# EAGLE design source_eagle (EAGLE 9.6.2)
COMPANY: ADAFRUIT INDUSTRIES; DRAWN: KTOWN; REV: B
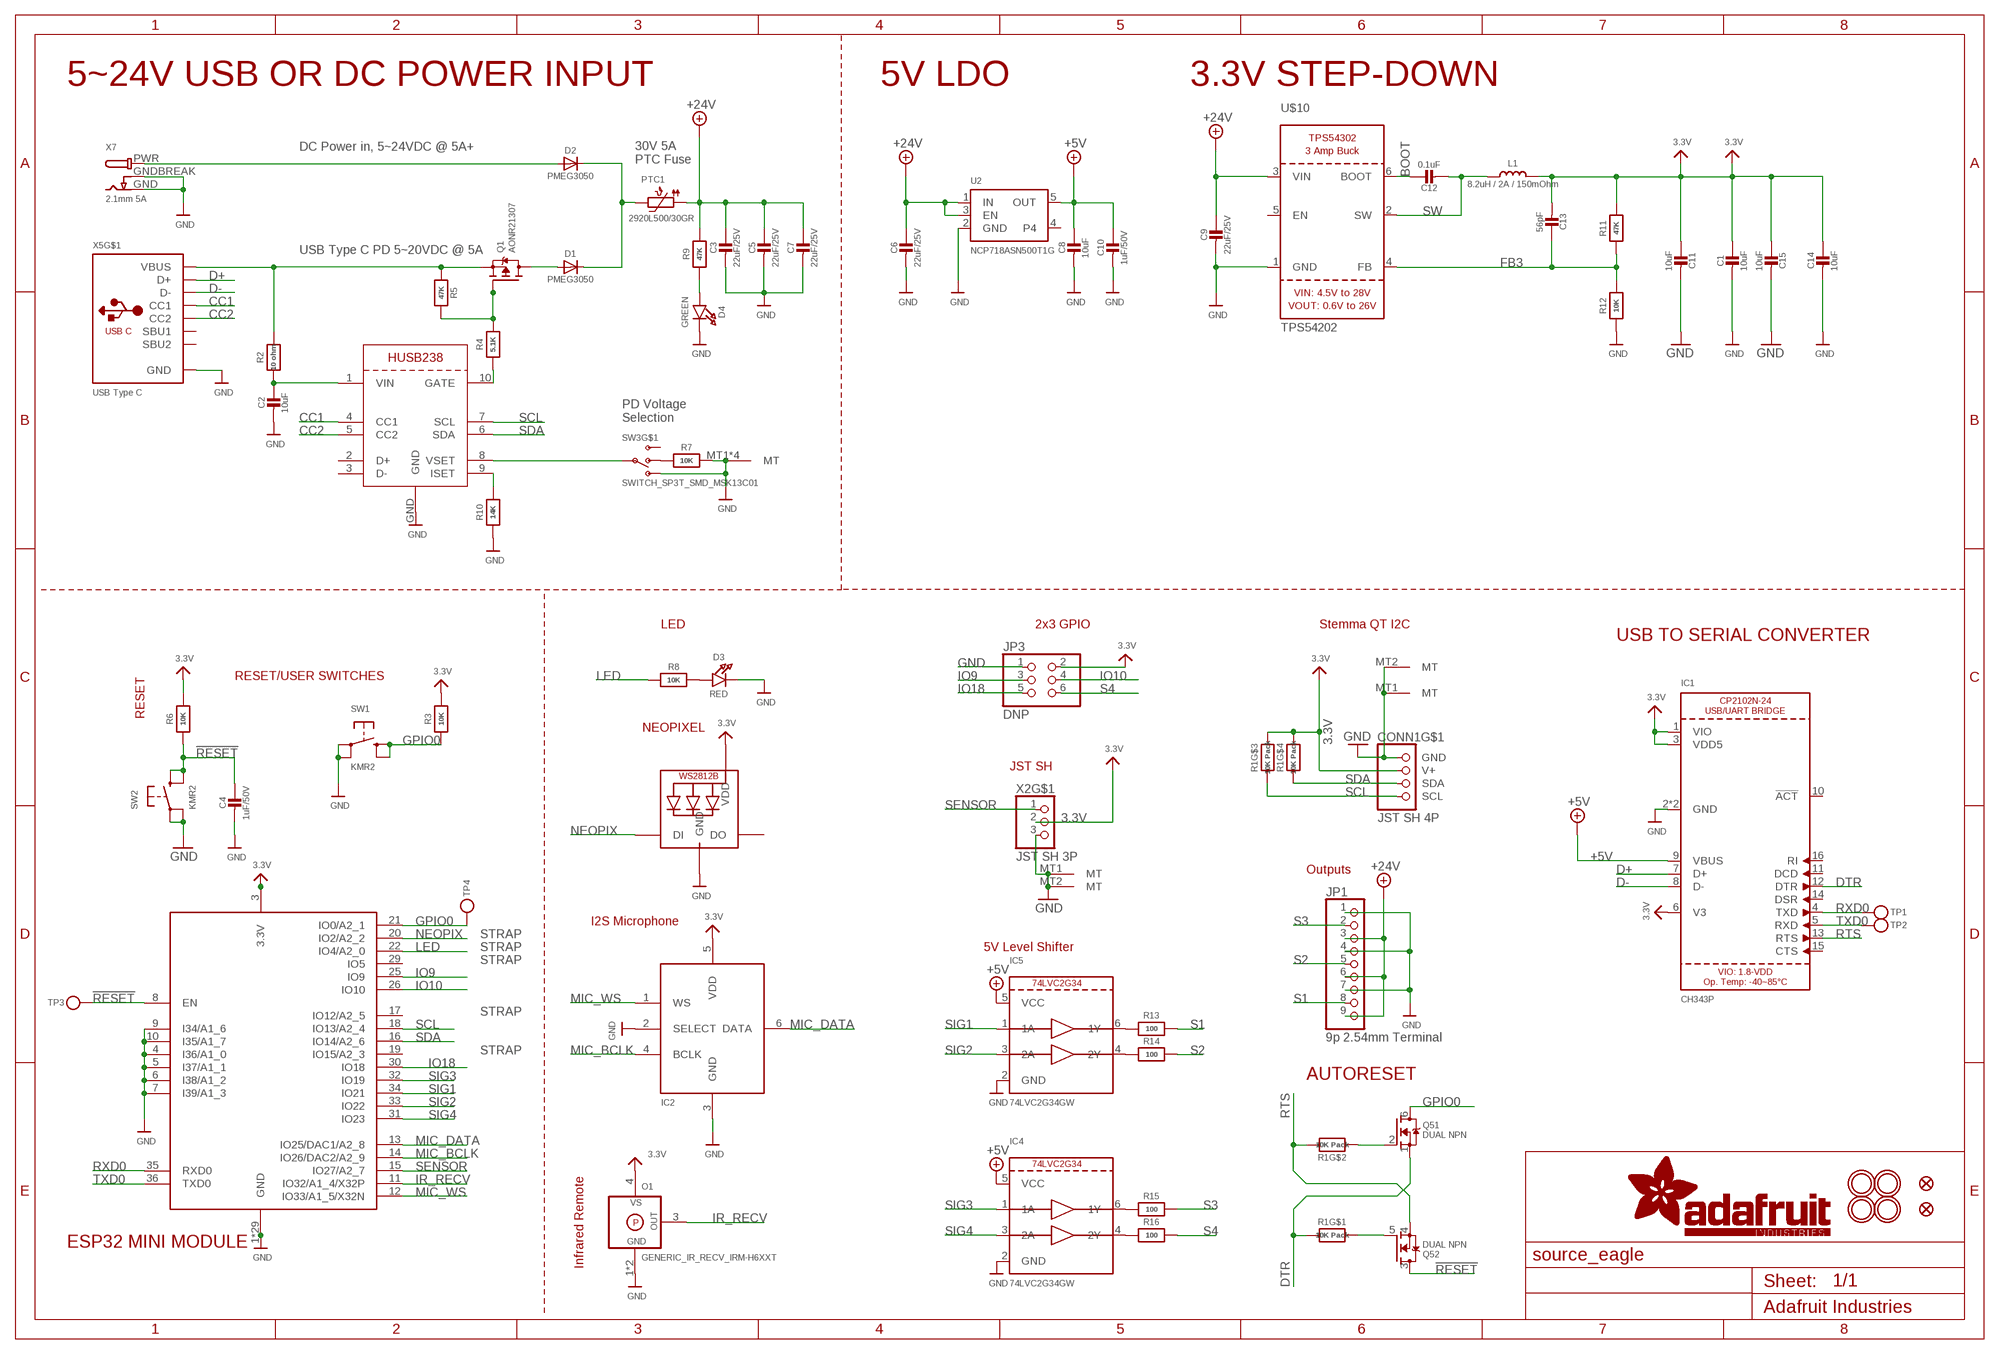
[diagram p0: schematic, sheet 1]

## Parts
C1  10uF  CAP_CERAMIC0805-NOOUTLINE  [0805-NO]
C2  10uF  CAP_CERAMIC0805-NOOUTLINE  [0805-NO]
C3  22uF/25V  CAP_CERAMIC0805-NOOUTLINE  [0805-NO]
C4  1uF/50V  CAP_CERAMIC0603_NO  [0603-NO]
C5  22uF/25V  CAP_CERAMIC0805-NOOUTLINE  [0805-NO]
C6  22uF/25V  CAP_CERAMIC0805-NOOUTLINE  [0805-NO]
C7  22uF/25V  CAP_CERAMIC0805-NOOUTLINE  [0805-NO]
C8  10uF  CAP_CERAMIC0805-NOOUTLINE  [0805-NO]
C9  22uF/25V  CAP_CERAMIC0805-NOOUTLINE  [0805-NO]
C10  1uF/50V  CAP_CERAMIC0603_NO  [0603-NO]
C11  10uF  CAP_CERAMIC0805-NOOUTLINE  [0805-NO]
C12  0.1uF  CAP_CERAMIC0603_NO  [0603-NO]
C13  56pF  CAP_CERAMIC0603_NO  [0603-NO]
C14  10uF  CAP_CERAMIC0805-NOOUTLINE  [0805-NO]
C15  10uF  CAP_CERAMIC0805-NOOUTLINE  [0805-NO]
CONN1  JST SH 4P  STEMMA_I2C_QT  [JST_SH4]
D1  PMEG3050  DIODE_SOD128  [SOD-128]
D2  PMEG3050  DIODE_SOD128  [SOD-128]
D3  RED  LED0603_NOOUTLINE  [CHIPLED_0603_NOOUTLINE]
D4  GREEN  LED0603_NOOUTLINE  [CHIPLED_0603_NOOUTLINE]
IC1  CH343P  [QFN16_3MM]
IC2  ICS-43434  MIC_I2S_SPH0645  [SPH0645LM4H]
IC4  74LVC2G34GW  [SC70-6L]
IC5  74LVC2G34GW  [SC70-6L]
JP1  9p 2.54mm Terminal  HEADER-1X9_2.54MMTERM  [1X09_2.54MMTERMINAL]
JP3  DNP  HEADER-2X3  [2X03_ROUND_70MIL]
L1  8.2uH / 2A / 150mOhm  INDUCTORNR5040  [INDUCTOR_5X5MM_NR5040_NOTHERMALS]
LED1  WS2812B_SK6805_1515  [SK6805_1515]
O1  GENERIC_IR_RECV_IRM-H6XXT  [IRM-H6XXT]
PTC1  2920L500/30GR  PTC_2920  [PTC2920]
Q1  AONR21307  MOSFET-P-POWERDI3333  [POWERDI3333]
Q5  DUAL NPN  MOSFET-N_DUAL  [SOT363]
R1  10K Pack  RESISTOR_4PACK  [RESPACK_4X0603]
R2  10 ohm  RESISTOR_0603_NOOUT  [0603-NO]
R3  10K  RESISTOR_0603_NOOUT  [0603-NO]
R4  5.1K  RESISTOR_0603_NOOUT  [0603-NO]
R5  47K  RESISTOR_0603_NOOUT  [0603-NO]
R6  10K  RESISTOR_0603_NOOUT  [0603-NO]
R7  10K  RESISTOR_0603_NOOUT  [0603-NO]
R8  10K  RESISTOR_0603_NOOUT  [0603-NO]
R9  47K  RESISTOR_0603_NOOUT  [0603-NO]
R10  14K  RESISTOR_0603_NOOUT  [0603-NO]
R11  47K  RESISTOR_0603_NOOUT  [0603-NO]
R12  10K  RESISTOR_0603_NOOUT  [0603-NO]
R13  100  RESISTOR_0603_NOOUT  [0603-NO]
R14  100  RESISTOR_0603_NOOUT  [0603-NO]
R15  100  RESISTOR_0603_NOOUT  [0603-NO]
R16  100  RESISTOR_0603_NOOUT  [0603-NO]
SW1  KMR2  SWITCH_TACT_SMT_RKB2  [BTN_RKB2_4.6X2.8]
SW2  KMR2  SWITCH_TACT_SMT_RKB2  [BTN_RKB2_4.6X2.8]
SW3  SWITCH_SP3T_SMD_MSK13C01  [MSK-13C01]
TP1  TESTPOINTROUND1.5MM  [TESTPOINT_ROUND_1.5MM]
TP2  TESTPOINTROUND1.5MM  [TESTPOINT_ROUND_1.5MM]
TP3  TESTPOINTROUND1.5MM  [TESTPOINT_ROUND_1.5MM]
TP4  TESTPOINTROUND1.5MM  [TESTPOINT_ROUND_1.5MM]
U2  NCP718ASN500T1G  VREG_SOT23-5  [SOT23-5]
U$10  TPS54202  TPS54302  [SOT23-6]
U$14  MOUNTINGHOLE2.5  [MOUNTINGHOLE_2.5_PLATED]
U$20  MOUNTINGHOLE2.5  [MOUNTINGHOLE_2.5_PLATED]
U$28  MOUNTINGHOLE2.5  [MOUNTINGHOLE_2.5_PLATED]
U$31  MOUNTINGHOLE2.5  [MOUNTINGHOLE_2.5_PLATED]
U$34  FIDUCIAL_1MM  [FIDUCIAL_1MM]
U$35  FIDUCIAL_1MM  [FIDUCIAL_1MM]
X2  JST SH 3P  CON_JST_SH_3PINHORZ  [JST_SH3]
X3  HUSB238  [DFN10_3X3MM]
X4  ESP32-MINI-1  [ESP32-MINI-1]
X5  USB Type C  USB_C  [USB_C_CUSB31-CFM2AX-01-X]
X7  2.1mm 5A  DCBARRELPTH  [DCJACK_2MM_PTH]

## Nets
3.3V: C1.1 C11.1 C13.2 C14.1 C15.1 CONN1.2(V+) IC1.1(VIO) IC1.3(VDD5) IC1.6(V3) IC2.5(VDD) JP3.2 L1.P$2 LED1.2(VDD) O1.4(VS) R1.5 R1.6 R3.2 R6.2 R11.2 X2.2 X4.3(3.3V)
!RESET: C4.1 Q5.3(2:D) R6.1 SW2.B'(S1) SW2.B(S) TP3.P$1 X4.8(EN)
+5V: C8.1 C10.1 IC1.9(VBUS) IC4.5(VCC) IC5.5(VCC) U2.5(OUT)
+24V: C3.1 C5.1 C6.1 C7.1 C9.1 JP1.3 JP1.6 JP1.9 PTC1.P$1 R9.2 U2.1(IN) U2.3(EN) U$10.3(VIN)
BOOT: C12.1 U$10.6(BOOT)
CC1: X3.4(CC1) X5.A5(CC1)
CC2: X3.5(CC2) X5.B5(CC2)
D+: IC1.7(D+) X5.A6(D+) X5.B6(D+)
D-: IC1.8(D-) X5.A7(D-) X5.B7(D-)
DTR: IC1.12(DTR) Q5.1(1:S) R1.1
FB3: C13.1 R11.1 R12.2 U$10.4(FB)
GND: C1.2 C2.2 C3.2 C4.2 C5.2 C6.2 C7.2 C8.2 C9.2 C10.2 C11.2 C14.2 C15.2 CONN1.1(GND) CONN1.MT1(MT) CONN1.MT2(MT) D3.C D4.C IC1.2(GND) IC1.THERMAL(GND) IC2.2(SELECT) IC2.3(GND) IC4.2(GND) IC5.2(GND) JP1.1 JP1.4 JP1.7 JP3.1 LED1.4(GND) O1.1(GND) O1.2(GND) R7.1 R10.1 R12.1 SW1.A'(P1) SW1.A(P) SW2.A'(P1) SW2.A(P) SW3.4 SW3.MT1(MT) SW3.MT2(MT) SW3.MT3(MT) SW3.MT4(MT) U2.2(GND) U$10.1(GND) X2.3 X2.MT1(MT) X2.MT2(MT) X3.GND X4.1(GND) X4.2(GND) X4.4(I36/A1_0) X4.5(I37/A1_1) X4.6(I38/A1_2) X4.7(I39/A1_3) X4.9(I34/A1_6) X4.10(I35/A1_7) X4.27(GND) X4.38(GND) X4.39(GND) X4.40(GND) X4.41(GND) X4.42(GND) X4.43(GND) X4.44(GND) X4.45(GND) X4.46(GND) X4.47(GND) X4.48(GND) X4.49(GND) X4.50(GND) X4.51(GND) X4.52(GND) X4.53(GND) X4.54(GND) X4.55(GND) X4.56(GND) X4.57(GND) X4.58(GND) X4.59(GND) X4.60(GND) X4.61(GND) X4.62(GND) X4.63(GND) X5.A1B12(GND) X5.B1A12(GND) X7.GND X7.GNDBREAK
GPIO0: Q5.6(1:D) R3.1 SW1.B'(S1) SW1.B(S) TP4.P$1 X4.21(IO0/A2_1)
IO9: JP3.3 X4.25(IO9)
IO10: JP3.4 X4.26(IO10)
IO18: JP3.5 X4.30(IO18)
IR_RECV: O1.3(OUT) X4.11(IO32/A1_4/X32P)
LED: R8.1 X4.22(IO4/A2_0)
MIC_BCLK: IC2.4(BCLK) X4.14(IO26/DAC2/A2_9)
MIC_DATA: IC2.6(DATA) X4.13(IO25/DAC1/A2_8)
MIC_WS: IC2.1(WS) X4.12(IO33/A1_5/X32N)
N$1: D3.A R8.2
N$2: C2.1 R2.1 X3.1(VIN)
N$3: Q1.4(G) R4.2 R5.2
N$4: R4.1 X3.10(GATE)
N$5: SW3.3(P) X3.8(VSET)
N$6: R7.2 SW3.2
N$7: Q5.5(2:G) R1.8
N$8: Q5.2(1:G) R1.2
N$9: D2.A X7.PWR
N$10: IC5.6(1Y) R13.1
N$11: IC5.4(2Y) R14.1
N$12: R10.2 X3.9(ISET)
N$13: D1.C D2.C PTC1.P$2
N$14: D1.A Q1.5678(D)
N$15: D4.A R9.1
N$18: IC4.6(1Y) R15.1
N$19: IC4.4(2Y) R16.1
NEOPIX: LED1.1(DI) X4.20(IO2/A2_2)
RTS: IC1.13(RTS) Q5.4(2:S) R1.7
RXD0: IC1.4(TXD) TP1.P$1 X4.35(RXD0)
S1: JP1.8 R13.2
S2: JP1.5 R14.2
S3: JP1.2 R15.2
S4: JP3.6 R16.2
SCL: CONN1.4(SCL) R1.3 X3.7(SCL) X4.18(IO13/A2_4)
SDA: CONN1.3(SDA) R1.4 X3.6(SDA) X4.16(IO14/A2_6)
SENSOR: X2.1 X4.15(IO27/A2_7)
SIG1: IC5.1(1A) X4.34(IO21)
SIG2: IC5.3(2A) X4.33(IO22)
SIG3: IC4.1(1A) X4.32(IO19)
SIG4: IC4.3(2A) X4.31(IO23)
SW: C12.2 L1.P$1 U$10.2(SW)
TXD0: IC1.5(RXD) TP2.P$1 X4.36(TXD0)
VBUS1: Q1.1(S) Q1.2(S) Q1.3(S) R2.2 R5.1 X5.A4B9(VBUS) X5.B4A9(VBUS)
Unconnected: IC1.10(!ACT) IC1.11(DCD) IC1.14(DSR) IC1.15(CTS) IC1.16(RI) LED1.3(DO) SW3.1 U2.4 U$10.5(EN) X3.2(D+) X3.3(D-) X4.17(IO12/A2_5) X4.19(IO15/A2_3) X4.29(IO5) X5.A8(SBU1) X5.B8(SBU2) X5.M1(MT) X5.M2(MT) X5.M3(MT) X5.M4(MT)

## Notes on the sheet
- 5~24V USB OR DC POWER INPUT | 5V LDO | 3.3V STEP-DOWN
- DC Power in, 5~24VDC @ 5A+
- 30V 5A
  PTC Fuse
- USB Type C PD 5~20VDC @ 5A
- PD Voltage
  Selection
- LED | 2x3 GPIO | Stemma QT I2C
- USB TO SERIAL CONVERTER
- RESET/USER SWITCHES
- RESET
- NEOPIXEL
- JST SH
- Outputs
- I2S Microphone
- STRAP
- STRAP | 5V Level Shifter
- STRAP
- STRAP
- STRAP
- AUTORESET
- Infrared Remote
- ESP32 MINI MODULE

## Library data of the parts
C1-C7 C9-C15 = microbuilder:CAP_CERAMIC: Ceramic Capacitors For new designs, use the packages preceded by an '_' character since they are more reliable: The following footprints should be used on most boards: _0402 - Standard footprint for regular board layouts _0603 - Standard footprint for regular board layouts _0805 - Standard footprint for regular board layouts _1206 - Standard footprint for regular board layouts For extremely tight-pitch boards where space is at a premium, the following 'micro-pitch' footprints can be used (smaller pads, no silkscreen outline, etc.): _0402MP - Micro-pitch footprint for very dense/compact boards _0603MP - Micro-pitch footprint for very dense/compact boards _0805MP - Micro-pitch footprint for very dense/compact boards _1206MP - Micro-pitch footprint for very dense/compact boards
C8 = microbuilder:CAP_CERAMIC: Ceramic Capacitors For new designs, use the packages preceded by an '_' character since they are more reliable: The following footprints should be used on most boards: _0402 - Standard footprint for regular board layouts _0603 - Standard footprint for regular board layouts _0805 - Standard footprint for regular board layouts _1206 - Standard footprint for regular board layouts For extremely tight-pitch boards where space is at a premium, the following 'micro-pitch' footprints can be used (smaller pads, no silkscreen outline, etc.): _0402MP - Micro-pitch footprint for very dense/compact boards _0603MP - Micro-pitch footprint for very dense/compact boards _0805MP - Micro-pitch footprint for very dense/compact boards _1206MP - Micro-pitch footprint for very dense/compact boards; REV: D
CONN1 = adafruit_electromech:STEMMA_I2C; LCSC: C2845363
D1 D2 = microbuilder:DIODE: Diode SMA Model Volts Amps Type Vf Ir Digikey # Notes SSA34-E3 40V 3A Schottky 480mV @ 3A 200uA @ 40V SSA34-E3/61TGITR-ND CDBA120-G 20V 1A Schottky 500mV @ 1A 500uA @ 20V 641-1014-6-ND REEL MBRA210 10V 2A Schottky 350mV @ 2A 700uA @ 10V MBRA210LT3 SOD-123 Model Volts Amps Type Vf Ir Order # Notes BAT54T1G 30V 200mA Schottky 800mV @ 200mA 2uA @ 25V BAT54T1GOSTR-ND B0530W 30V 500mA Schottky 430mV @ 500mA 130uA @ 30V B0530W-FDICT-ND REEL MBR120 20V 1A Schottky 340mV @ 1A MBR120VLSFT1GOSCT-ND SOD-323 Model Volts Amps Type Vf Ir Order # Notes PMEG2005EJ 20V 500mA Schottky 355mV @ 500mA 568-4110-1-ND ZLLS410 10V 570mA Schottky 380mV @ 570mA ZLLS410CT-ND 1N4148WS 75V 150mA Silicon/Simple 1V 1N4148WSFSCT-ND REEL SOD-523 Model Volts Amps Type Vf Ir Order # Notes BAT54XV2 30V 200mA Schottky 0.8V @ 100mA BAT54XV2CT-ND TB751S 30V 30mA Schottky RB751S-40TE61CT-ND SOT23-R/W (R = Solder Paste/Reflow Ovens, W = Hand-Soldering) Model Volts Amps Type Vf Ir Order # Notes BAT54FILM 40V 300mA Schottky 497-7162-1-ND POWERDI-5 Model Volts Amps Type Vf Ir Order # Notes PDS560 60V 5A Schottky 670mV @ 5A 150uA @ 60V PDS560DICT-ND
D3 D4 = microbuilder:LED: LED 0603 - 0603 Surface Mount Package 2mA: Green LED - Low Power (3.9mcd, 2ma, 1.7Vf) - Digikey: 475-2709-2-ND Orange LED - Low Power (9.8mcd, 2ma, 1.8Vf) - Digikey: 475-1194-2-ND Red LED - Low Power (5mcd, 2ma, 1.8Vf) - Digikey: 475-1195-2-ND Yellow LED - Low Power (7mcd, 2ma, 1.8Vf) - Digikey: 475-1196-2-ND 5mA: Blue LED - Low Power (17mcd, 5ma, 2.9Vf) - Digikey: LNJ937W8CRACT-ND 0805 - 0805 Surface Mount Package 2mA: Red LED (8.8mcd, 2mA, 1.8Vf, Clear) - Low Power [Digikey: 475-2510-1-ND] Green LED (5mcd, 2mA, 1.8Vf, Clear) - Low Power [Digikey: 475-2730-1-ND] Yellow LED (11.3mcd, 2mA, 1.8Vf, Clear) - Low Power [Digikey: 475-2555-1-ND] 20mA: Red LED (104mcd, 20mA, Diffused) - LS R976 [Digikey: 475-1278-6-ND] Red LED (12mcd, 20mA, 2.0Vf, Clear) - APT2012EC [Digikey: 754-1128-1-ND] Green LED (15mcd, 20mA, 2.2Vf, Clear) - APT2012GC [Digikey: 754-1131-1-ND] Orange LED (160mcd, 20mA, 2.1Vf, Clear) - APT2012SECK [Digikey: 754-1130-1-ND] 1206 - 1206 Surface Mount Package Green LED (26mcd, 20mA, Diffused) - LG N971 [Digikey: 475-1407-6-ND] Red LED (15mcd, 20mA, Diffused) - LH N974 [Digikey: 475-1416-6-ND] Cree - Cree High-Power Surface Mount LEDs XPEBWT-L1-0000-00D50 - White 111lm 350mA 2.9Vf 6200K 110° XTEAWT-00-0000-00000LEE3 - White 114lm 350mA 2.85Vf 5000K 115° Everlight - Everlight 45-21 Series Surface Mount LEDs 45-21/QK2C-B2832AC2CB2/2T - Warm White 2000mcd 20mA 3.25Vf 3050K 120° 45-21/LK2C-B38452C4CB2/2T - Nuetral White 2000mcd 20mA 3.25Vf 4150K 120° 45-21/LK2C-B50634C6CB2/2T - Cold White 2200mcd 20mA 3.25Vf 5650K 120° PLCC2 Reverse Mount LS T77K-J1L2-1-0-2-R18-Z - Red 11.25mcd 2mA 1.8Vf 630nm 120° LO T77K-L1M2-24-Z - Orange 19.6mcd 2mA 1.8Vf 606nm 120° LY T77K-K2M1-26-Z - Yellow 15.7mcd 2mA 1.8Vf 587nm 120°; ROT: 270
IC1 = microbuilder:CH343P
IC2 = microbuilder:MIC_I2S
IC4 IC5 = microbuilder:74LVC2G34
JP1 = microbuilder:HEADER-1X9: PIN HEADER
JP3 = microbuilder:HEADER-2X3: PIN HEADER
L1 = microbuilder:INDUCTOR: Inductors 0603: 10nH Ceramic Inductor - microwire antenna/RF (Digikey: 712-1434-2-ND) 0805: 560nH Ceramic Inductor - RF (Digikey: 553-1047-1-ND) 270nH Ceramic Inductor - Q = 40@250MHz, +-5%, 1 Ohm DC Resistance (Digikey: 535-10506-2-ND) 1007 (2518 Metric) SMT: 10µH 10% 250mOhm 820mA 1007 Inductor (Digikey: 587-2189-1-ND) 22µH 10% 500mOhm 580mA 1007 Inductor (Digikey: 587-2190-1-ND) 47µH 10% 950mOhm 420mA 1007 Inductor (Digikey: 587-2191-1-ND) 47µH 5% 100mOhm 1A 1008 Inductor (Digikey: 732-1816-1-ND) 5.0x5.0mm (Taiyo Yuden NR5040 Series) 6.8µH 20% 2.3A 64mOhm Inductor (Digikey: 587-2374-2-ND) 5.0x5.0mm (TDK VLC5045 Series) 4.7µH 20% 3.3A 34mOhm Inductor (Digikey: 445-6526-1-ND) 6.8µH 20% 2.7A 46mOhm Inductor (Digikey: 445-6527-1-ND) 6.0x6.0mm (TDK VLC6045 Series) 4.7µH 20% 3.8A 27mOhm Inductor (Digikey: 445-6538-2-ND) 6.8µH 20% 3A 41mOhm Inductor (Digikey: 445-6540-1-ND) 6.2µH 30% 2.2A 45mOhm Inductor (Digikey: SRR5028-6R2YCT-ND) - Not TDK VLC6045 but footprint should match 6.0x6.0mm (TDK SLF6045 Series) 6.8uH 30% 2A 33mOhm Inductor (Digikey: 445-4572-1-ND, Mouser: 810-SLF645T6R8N2R0PF) 6.0x6.0mm (Sumida CDRH5D28 Series) 6.2uH 30% 1.8A 45mOhm Inductor (Digikey: 308-1542-1-ND) Taiyo Yuden NR3015T2R2M - 2.2uH 20% 1.5A (Digikey: 587-1648-2-ND, Mouser: 963-NR3015T2R2M) - Used with TI TPS62172 CoilCraft RFID Transponder Coil - MA5532-AE (For use with AS3935 Lightning Sensor) Taiyo Yuden NRH2412T2R2MNGH - 2.2uH 20% 1AA (Digikey: 587-3443-1-ND) - Used with TI LM3671 Vishay IHLP 1.0uH Molded Inductor - 24mOhm DCR, 5A, +/-20%, -55°C-125°C (Digikey: 541-1319-1-ND)
LED1 = microbuilder:WS2812B; LCSC: C2890035
O1 = adafruit_sensor:GENERIC_IR_RECV
PTC1 = microbuilder:PTC: PTC (Resettable Fuse) 1206 Package 250mA PTC (16V Max, Time-to-Trip: 0.08s) - Digikey: F2110CT-ND 1210 Package 100mA PTC (30V Max, Time-to-Trip: 0.6s) - Digikey: MF-USMF010-2CT-ND 1812 Package 750mA PTC (24V Max, Time-to-Trip: 0.2s) - Digikey: MF-MSMF075/24-2CT-ND
Q1 = microbuilder:MOSFET-P: P-Channel Mosfet LEGEND VDS: Voltage Drain-Source ID: Drain Current RDS(ON): Drain-Source On-State Resistance VGS(TH): Gate-Source Threshold Voltage CISS: Drain-Source Input Capacitance SOT-23 Name VDS ID RDS(ON) VGS(TH) CISS Order Number IRLML5103 30V 760mA 600 mOhm -- 75pF @ 25V Digikey: IRLML5103PBFCT-ND IRLML6401 12V 4.3A 50 mOhm 950mV @ 250µA 830pF @ 10V Digikey: IRLML6401PBFTR-ND NTR0202PL 20V 400mA 800 mOhm 2.3V @ 250uA 70pF @ 5V Digikey: NTR0202PLT1GOSTR-ND NTR4101PT1G 20V 1.8A 85 mOhm 1.2V @ 250uA 675pF @ 10V Digikey: NTR4101PT1GOSCT-ND DMP2004K 20V 600mA 900 mOhm 1V @ 250uA 175pF @ 16V Digikey: DMP2004KDICT-ND PMV65XP 20V 3.9A 76 mOhm 950mV @ 1mA 725pF @ 20V Digikey: 568-2358-2-ND TO-252 Name VDS ID RDS(ON) VGS(TH) CISS Order Number AOD417 30V 25A 34 mOhm 3V @ 250µA 920pF @ 15V Digikey: 785-1106-2-ND PowerPak Name VDS ID RDS(ON) VGS(TH) CISS Order Number AON7401 30V 12A 14 mOhm 3V @ 250µA 2600pF @ 15V Digikey: 785-1302-1-ND; ROT: 270
Q5 = microbuilder:MOSFET-N_DUAL: Dual N-Channel MOSFET SOT363 (2.0x1.25mm) 2N7002PS - 60V, 320mA [Digikey: 568-5984-1-ND]; JLC_ROTATION: 0
R1 = microbuilder:RESISTOR_4PACK: Resistor Packs (4 resistors) 4 x 0603 10K 1/16W - Digikey: YC164J-10KCT-ND
R2-R16 = microbuilder:RESISTOR: Resistors For new designs, use the packages preceded by an '_' character since they are more reliable: The following footprints should be used on most boards: _0402 - Standard footprint for regular board layouts _0603 - Standard footprint for regular board layouts _0805 - Standard footprint for regular board layouts _1206 - Standard footprint for regular board layouts For extremely tight-pitch boards where space is at a premium, the following 'micro-pitch' footprints can be used (smaller pads, no silkscreen outline, etc.): _0402MP - Micro-pitch footprint for very dense/compact boards _0603MP - Micro-pitch footprint for very dense/compact boards _0805MP - Micro-pitch footprint for very dense/compact boards _1206MP - Micro-pitch footprint for very dense/compact boards
SW1 SW2 = adafruit_electromech:SWITCH_TACT_SMT: SMT Tact Switches RKB2 https://www.digikey.com/short/m027prz5
SW3 = adafruit_electromech:SWITCH_SP3T_SMD
TP1-TP4 = microbuilder:TESTPOINT: Test Point Various test points for characterisation and PCB testing TESTPOINT_SMT - Compact Surface Mount Test Point [Digikey: 5016KTR-ND]
U2 = adafruit_power:VREG_SOT23-5: SOT23-5 Fixed Voltage Regulators Part Current Out V Out V In V Dropout θJA (°C/W) TJ (°C) Digikey Part No. ADP121 150mA 3.3V 3.4-5.5V 0.09V @ 150mA -- -- ADP121-AUJZ33R7CT-ND ADP121 150mA 3.0V 3.1-5.5V 0.09V @ 150mA -- -- ADP121-AUJZ30R7CT-ND ADP122 300mA 3.3V 3.4-5.5V 0.085V @ 300mA -- -- ADP122AUJZ-3.3-R7CT-ND ADP1712 300mA 3.3V 3.5-5.5V 0.17V @ 300mA -- -- ADP1712AUJZ-3.3-R7TR-ND AP7311 (Low Cost) 150mA 3.3V 3.5-6V 0.15V @ 150mA -- -- AP7311-33WG-7DICT-ND LD39015M18R 150mA 1.8V 1.9V-5.5V 0.08V @ 100mA -- -- 497-6977-1-ND LP2985A-33DBVR 150mA 3.3V 3.3-16V 0.28V @ 150mA 206 150 296-18479-1-ND MCP1824T-3302E/OT 300mA 3.3V 3.5V-6V 0.2V @ 300mA -- -- MCP1824T-3302E/OTCT-ND MIC5205-2.5YM5 TR 150mA 2.5V 2.7-16V 0.165V @ 150mA -- -- 576-1257-2-ND MIC5205-3.0YM5 TR 150mA 3.0V 3.2V-16V 0.165V @ 150mA -- -- 576-1258-2-ND MIC5205-3.3YM5 TR 150mA 3.3V 3.5V-16V 0.165V @ 150mA -- -- 576-1259-2-ND TPS780330220 150mA 3.3V+2.2V 3.6-5.5V 250mV Max -- -- 296-23332-1-ND TDA3663/N1,135 100mA 3.3V 3.5-45V 0.18V @ 50mA -- -- 568-5343-1-ND Max operating temp can be calculated using θJA, TJ (max junction temperature), and power in watts. Set the "Maximum Ambient Temperature" until it reaches TJ ("Max Junction Temperature"), which is the absolute limit for safe use of the regulator: Heat Sink Temperature Calculator <http://www.daycounter.com/Calculators/Heat-Sink-Temperature-Calculator.phtml> For example, With 12V source into a 3.3V LP2985 and a 30mA load, we are dissipating (12V-3.3V) * 0.03A = 0.261W. With a θJA of 206 °C/W, a TJ of 150°C, and 261mW we can safely use the chip without a heat sink up to 75°C (=147.1°C Junction Temperature).; JLC_ROTATION: 0
U$10 = adafruit_power:TPS54302
U$14 U$20 U$28 U$31 = adafruit_electromech:MOUNTINGHOLE: Mounting Hole For #2 screws (0.086"/2.18mm width, 0.094"/2.4mm hole) use 2.5mm; BOM: EXCLUDE
U$34 U$35 = microbuilder:FIDUCIAL: Fiducial Alignment Points Various fiducial points for machine vision alignment.; BOM: EXCLUDE
X2 = adafruit_electromech:CON_JST_SH_3PIN
X3 = adafruit_power:HUSB238
X4 = adafruit_wireless:ESP32-MINI-1
X5 = adafruit_electromech:USB_C: USB Type-C USB 2.0 Connector; LCSC: C165948
X7 = adafruit_electromech:DCBARREL: DC Barrel Jack DCJACK_1.3MM_PTH - Through Hole 1.3mm Jack (4UConnector: 05536) DCJACK_2MM_PTH - Through Hole 2.0/2.1 Jack (4UConnector: 05537) DCJACK_2MM_SMT - SMT 2.0/2.1mm Jack(4UConnector: 03267)

## Net classes
1 power: width 0.305 mm

## Board
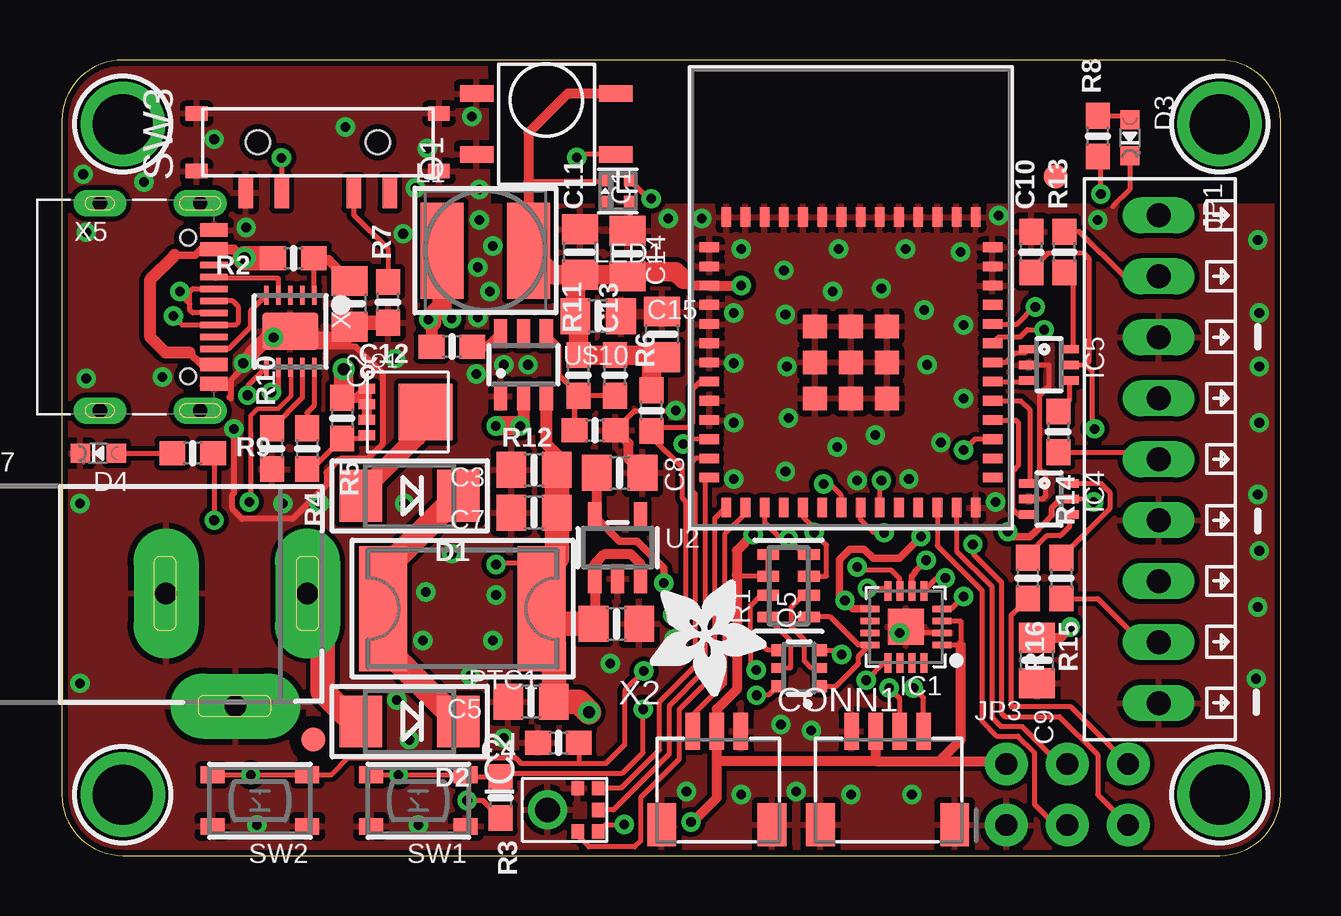
[diagram p1: board, top side]
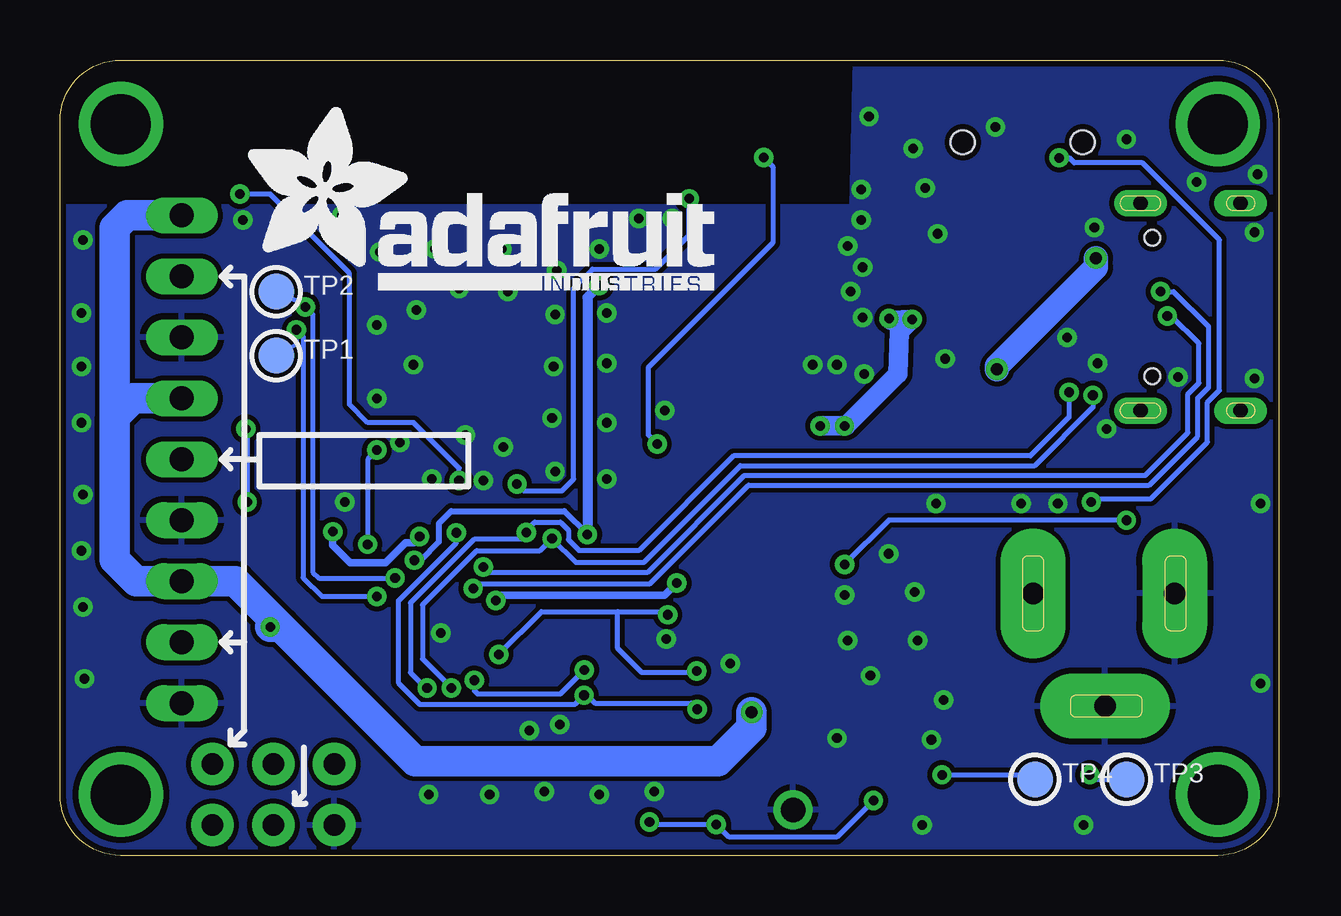
[diagram p2: board, bottom side, seen from below]

Size 50.8 x 33.15 mm. Coordinates in mm from the lower left corner, seen from the top.
Outline: 48.26,33.15 2.54,33.15 arc90 0,30.61 0,2.54 arc90 2.54,0 48.26,0 arc90 50.8,2.54 50.8,30.61 arc90 48.26,33.15
Copper layers (1*16): Top 0.035mm / dielectric 1.5mm / Bottom 0.035mm
Design rules "adafruit 7-7": minimum track width 7mil, minimum drill 15.5mil, track to track 8mil, track to pad 7mil, pad to pad 7mil, via to via 7mil, smd to smd 7mil, copper to edge 10mil, drill to drill 8mil, minimum pad ring 10mil, minimum via ring 8mil, stop-mask expansion 2mil, vias tented up to drill 20mil, thermal gap 10mil

### Footprints (pad centres in the part's own frame; a part is rotated, then mirrored left to right if it is on the bottom)
0805-NO = smd 1.24 x 1.5: 1 -0.95,0; 2 0.95,0
0603-NO = smd 1.075 x 1: 1 -0.85,0; 2 0.85,0
JST_SH4 = smd 0.6 x 1.55: 1 -1.5,2.006; 2 -0.5,2.006; 3 0.5,2.006; 4 1.5,2.006 | smd 1.2 x 1.8: MT1 -2.8,-1.894; MT2 2.8,-1.894
SOD-128 = smd 1.778 x 2.159: A 2.019,0; C -2.045,0
CHIPLED_0603_NOOUTLINE = smd 0.8 x 0.8: A 0,-0.75; C 0,0.75
QFN16_3MM = smd 0.8 x 0.28: 1 -1.5,0.75; 2 -1.5,0.25; 3 -1.5,-0.25; 4 -1.5,-0.75; 9 1.5,-0.75; 10 1.5,-0.25; 11 1.5,0.25; 12 1.5,0.75 | smd 0.28 x 0.8: 5 -0.75,-1.5; 6 -0.25,-1.5; 7 0.25,-1.5; 8 0.75,-1.5; 13 0.75,1.5; 14 0.25,1.5; 15 -0.25,1.5; 16 -0.75,1.5 | smd 1.5 x 1.5: THERMAL 0,0
SPH0645LM4H = smd 0.6 x 0.525: 1 -0.9,1.4; 2 -0.9,0.55; 4 0.9,0.55; 5 0.9,1.4; 6 0,1.4 | drill 1.025 pad 1.625: 3 0,-0.71
SC70-6L = smd 0.35 x 0.8: 1 -0.65,-0.85; 2 0,-0.85; 3 0.65,-0.85; 4 0.65,0.85; 5 0,0.85; 6 -0.65,0.85
1X09_2.54MMTERMINAL = drill 1 long: 1 10.16,0; 2 7.62,0; 3 5.08,0; 4 2.54,0; 5 0,0; 6 -2.54,0; 7 -5.08,0; 8 -7.62,0; 9 -10.16,0
2X03_ROUND_70MIL = drill 0.9 pad 1.778: 1 -2.54,-1.27; 2 -2.54,1.27; 3 0,-1.27; 4 0,1.27; 5 2.54,-1.27; 6 2.54,1.27
INDUCTOR_5X5MM_NR5040_NOTHERMALS = smd 1.8 x 4: P$1 -1.8,0; P$2 1.8,0
SK6805_1515 = smd 0.5 x 0.5: 1 -0.5,-0.45; 2 0.5,-0.45; 3 0.5,0.45; 4 -0.5,0.45
IRM-H6XXT = smd 0.7 x 1.4: 1 1.27,2.9; 2 -1.27,2.9; 3 -1.27,-2.9; 4 1.27,-2.9
PTC2920 = smd 2 x 5.2: P$1 -3.3,0; P$2 3.3,0
POWERDI3333 = smd 0.7 x 0.42: 1 -1.446,0.975; 2 -1.446,0.325; 3 -1.446,-0.325; 4 -1.446,-0.975 | smd 2.25 x 2.35: 5678 1.004,0
SOT363 = smd 0.5 x 0.5: 1 -0.75,-0.9; 3 0.75,-0.9; 4 0.75,0.9; 6 -0.75,0.9 | smd 0.4 x 0.5: 2 0,-0.9; 5 0,0.9
RESPACK_4X0603 = smd 0.45 x 0.9: 1 -1.3,-0.85; 2 -0.4,-0.85; 3 0.4,-0.85; 4 1.3,-0.85; 5 1.3,0.85; 6 0.4,0.85; 7 -0.4,0.85; 8 -1.3,0.85
BTN_RKB2_4.6X2.8 = smd 1 x 0.7: A 1.973,1.075; A' -1.973,1.075; B 1.973,-1.075; B' -1.973,-1.075
MSK-13C01 = smd 0.6 x 1.3: 1 -3,2.1; 2 -1.5,2.1; 3 1.5,2.1; 4 3,2.1 | smd 0.9 x 0.6: MT1 -5.05,1.2; MT2 -5.05,-1.2; MT3 5.05,-1.2; MT4 5.05,1.2 | hole 1: 2.5,0; -2.5,0
TESTPOINT_ROUND_1.5MM = smd 1.5 x 1.5: P$1 0,0
SOT23-5 = smd 0.55 x 1.2: 1 -0.95,-1.3; 2 0,-1.3; 3 0.95,-1.3; 4 0.95,1.3; 5 -0.95,1.3
SOT23-6 = smd 0.55 x 1.2: 1 -0.95,-1.3; 2 0,-1.3; 3 0.95,-1.3; 4 0.95,1.3; 5 0,1.3; 6 -0.95,1.3
MOUNTINGHOLE_2.5_PLATED = drill 2.5 pad 3.2: P$1 0,0
FIDUCIAL_1MM = smd 1 x 1: 1 0,0
JST_SH3 = smd 0.6 x 1.55: 1 -1,2.006; 2 0,2.006; 3 1,2.006 | smd 1.2 x 1.8: MT1 -2.3,-1.894; MT2 2.3,-1.894
DFN10_3X3MM = smd 0.25 x 0.8: 1 -1,-1.5; 2 -0.5,-1.5; 3 0,-1.5; 4 0.5,-1.5; 5 1,-1.5; 6 1,1.5; 7 0.5,1.5; 8 0,1.5; 9 -0.5,1.5; 10 -1,1.5 | smd 2.35 x 1.58: GND 0,0
ESP32-MINI-1 = smd 0.813 x 0.406: 1 -5.9,4.9; 2 -5.9,4.1; 3 -5.9,3.3; 4 -5.9,2.5; 5 -5.9,1.7; 6 -5.9,0.9; 7 -5.9,0.1; 8 -5.9,-0.7; 9 -5.9,-1.5; 10 -5.9,-2.3; 11 -5.9,-3.1; 12 -5.9,-3.9; 13 -5.9,-4.7; 28 5.9,-4.7; 29 5.9,-3.9; 30 5.9,-3.1; 31 5.9,-2.3; 32 5.9,-1.5; 33 5.9,-0.7; 34 5.9,0.1; 35 5.9,0.9; 36 5.9,1.7; 37 5.9,2.5; 38 5.9,3.3; 39 5.9,4.1; 40 5.9,4.9 | smd 0.406 x 0.813: 14 -5.2,-5.95; 15 -4.4,-5.95; 16 -3.6,-5.95; 17 -2.8,-5.95; 18 -2,-5.95; 19 -1.2,-5.95; 20 -0.4,-5.95; 21 0.4,-5.95; 22 1.2,-5.95; 23 2,-5.95; 24 2.8,-5.95; 25 3.6,-5.95; 26 4.4,-5.95; 27 5.2,-5.95; 41 5.2,6.15; 42 4.4,6.15; 43 3.6,6.15; 44 2.8,6.15; 45 2,6.15; 46 1.2,6.15; 47 0.4,6.15; 48 -0.4,6.15; 49 -1.2,6.15; 50 -2,6.15; 51 -2.8,6.15; 52 -3.6,6.15; 53 -4.4,6.15; 54 -5.2,6.15 | smd 0.991 x 0.991: 55 -1.5,1.6; 56 0,1.6; 57 1.5,1.6; 58 -1.5,0.1; 59 0,0.1; 60 1.5,0.1; 61 -1.5,-1.4; 62 0,-1.4; 63 1.5,-1.4
USB_C_CUSB31-CFM2AX-01-X = smd 0.575 x 1.15: A1B12 -3.2,2.275; A4B9 -2.4,2.275; B1A12 3.2,2.275; B4A9 2.4,2.275 | smd 0.275 x 1.15: A5 -1.25,2.275; A6 -0.25,2.275; A7 0.25,2.275; A8 1.25,2.275; B5 1.75,2.275; B6 0.75,2.275; B7 -0.75,2.275; B8 -1.75,2.275 | drill 0.6 pad 1 long: M1 -4.32,1.7; M2 4.32,1.7; M3 -4.32,-2.48; M4 4.32,-2.48 | hole 0.65: 2.89,1.2; -2.89,1.2
DCJACK_2MM_PTH = drill 0.9 pad 2.7 long: GND -2.9,2.54; GNDBREAK 0,-2.16; PWR 3,2.54

### Placement (x,y rotation side)
C1  23.57,25.08 90 top
C2  12,22.99 270 top
C3  19.68,16.07 180 top
C4  20.7,4.7 180 top
C5  19.56,6.41 180 top
C6  23.11,9.65 0 top
C7  19.68,14.29 180 top
C8  23.25,15.94 0 top
C9  40.64,8.13 270 top
C10  40.41,25.15 90 top
C11  21.59,25.15 90 top
C12  16.26,21.21 180 top
C13  23.05,20 90 top
C14  25.02,21.72 90 top
C15  22.35,22.48 0 top
CONN1  34.42,3.17 0 top
D1  14.48,14.99 180 top
D2  14.48,5.59 180 top
D3  44.51,29.91 180 top
D4  1.52,16.76 90 top
IC1  35.18,9.53 180 top
IC2  20.95,1.91 270 top
IC4  41.15,14.86 270 top
IC5  41.15,20.45 270 top
JP1  45.72,16.51 270 top
JP3  41.91,2.54 0 top
L1  17.65,25.21 0 top
LED1  23.18,27.69 180 top
O1  20.19,30.48 90 top
PLABEL0  [PLABEL0]  12.26,1.59 90 top
PLABEL1  [PLABEL1]  5.52,0.64 90 top
PLABEL2  [PLABEL2]  36.58,5.21 0 top
PLABEL3  [PLABEL3]  24.13,5.14 0 top
PLABEL4  [PLABEL4]  25.15,27.81 90 top
PLABEL6  [PLABEL6]  49.78,24.13 90 top
PLABEL7  [PLABEL7]  6.92,32 0 top
PLABEL8  [PLABEL8]  10.67,32 0 top
PLABEL9  [PLABEL9]  14.22,32 0 top
PLABEL10  [PLABEL10]  10.79,26.16 0 top
PLABEL11  [PLABEL11]  49.78,26.67 90 top
PLABEL13  [PLABEL13]  49.78,16.51 90 top
PLABEL14  [PLABEL14]  49.78,19.05 90 top
PLABEL16  [PLABEL16]  49.78,8.89 90 top
PLABEL17  [PLABEL17]  49.78,11.43 90 top
PLABEL19  [PLABEL19]  3.37,16.76 90 top
PLABEL20  [PLABEL20]  22.54,29.97 0 top
PLABEL21  [PLABEL21]  42.93,31.69 0 top
PLABEL22  [PLABEL22]  23.94,2.03 90 top
PLABEL23  [PLABEL23]  42.67,10.73 0 bottom
PLABEL24  [PLABEL24]  39.69,23.5 0 bottom
PLABEL25  [PLABEL25]  39.69,20.83 0 bottom
PLABEL26  [PLABEL26]  49.02,26.67 0 bottom
PLABEL27  [PLABEL27]  48.77,19.05 0 bottom
PLABEL28  [PLABEL28]  48.83,11.37 0 bottom
PLABEL29  [PLABEL29]  49.02,6.29 0 bottom
PLABEL30  [PLABEL30]  48.96,13.97 0 bottom
PLABEL31  [PLABEL31]  48.96,21.53 0 bottom
PLABEL32  [PLABEL32]  48.9,24.13 0 bottom
PLABEL33  [PLABEL33]  48.96,16.51 0 bottom
PLABEL34  [PLABEL34]  48.9,8.76 0 bottom
PLABEL35  [PLABEL35]  46.04,3.87 90 bottom
PLABEL36  [PLABEL36]  46.04,1.21 90 bottom
PLABEL37  [PLABEL37]  41.97,5.52 90 bottom
PLABEL38  [PLABEL38]  37.78,4.06 90 bottom
PLABEL39  [PLABEL39]  37.66,1.14 90 bottom
PLABEL40  [PLABEL40]  40.51,5.21 90 bottom
PLABEL41  [PLABEL41]  41.97,16.57 0 bottom
PLABEL42  [PLABEL42]  20.07,4.57 0 bottom
PLABEL43  [PLABEL43]  16.57,32.19 0 bottom
PLABEL44  [PLABEL44]  30.67,31.31 0 bottom
PLABEL45  [PLABEL45]  2.03,9.72 90 bottom
PLABEL46  [PLABEL46]  4.06,16.64 0 bottom
PLABEL47  [PLABEL47]  4.45,23.18 0 bottom
PLABEL48  [PLABEL48]  20.89,15.49 0 bottom
PLABEL49  [PLABEL49]  28.96,1.27 0 bottom
PLABEL50  [PLABEL50]  13.97,1.46 0 bottom
PLABEL51  [PLABEL51]  44.2,32.19 0 bottom
PLABEL52  [PLABEL52]  7.37,32.13 0 bottom
PLABEL53  [PLABEL53]  15.34,24.92 0 bottom
PLABEL54  [PLABEL54]  32.83,29.91 0 top
PLABEL55  [PLABEL55]  38.35,9.53 90 top
PLABEL56  [PLABEL56]  0.19,5.02 0 top
PTC1  16.7,10.29 180 top
Q1  14.16,18.48 0 top
Q5  30.73,7.81 90 top
R1  30.29,11.24 90 top
R2  9.65,24.89 180 top
R3  18.29,2.41 270 top
R4  10.22,16.95 270 top
R5  11.68,18.22 270 top
R6  24.57,18.54 90 top
R7  13.59,23.05 90 top
R8  43.18,29.97 90 top
R9  5.46,16.76 0 top
R10  8.76,16.95 90 top
R11  21.53,20 90 top
R12  22.23,17.72 180 top
R13  41.78,25.15 90 top
R14  41.53,17.65 270 top
R15  41.66,11.56 270 top
R16  40.26,11.56 270 top
SW1  14.86,2.29 180 top
SW2  8.26,2.29 180 top
SW3  10.67,29.72 180 top
TP1  41.78,20.83 0 bottom
TP2  41.78,23.5 0 bottom
TP3  6.35,3.17 0 bottom
TP4  10.16,3.17 0 bottom
U2  23.16,12.83 0 top
U$10  19.24,20.45 0 top
U$14  2.54,2.54 0 top
U$20  48.26,30.48 0 top
U$28  2.54,30.48 0 top
U$31  48.26,2.54 0 top
U$34  10.48,4.83 270 top
U$35  41.42,28.3 270 top
U$46  [ADAFRUIT_5MM]  24.51,11.49 270 top
U$50  [ADAFRUIT_TEXT_20MM]  43.12,23.56 0 bottom
X2  27.3,3.17 0 top
X3  9.53,21.84 180 top
X4  32.89,20.45 0 top
X5  4.06,22.86 270 top
X7  7.24,8.38 0 top

### Tracks (layer width: path | path; a pad name or v marks a point on that pad's centre or on a via)
3.3V  (via drill 0.4)
  Top 0.203: IC1.3 37.47,9.78 37.47,8.89 37.47,8.78 IC1.1 | R1.5 R1.6 28.18,11.64 28.13,11.68 | IC2.5 22.64,1.29 v23.44,1.29 | R3.2 17.57,2.29 v16.89,2.29 | LED1.2 22.61,28.07 19.45,28.07
  Top 0.254: IC1.6 35.43,11.64 35.58,11.79 35.58,11.85 v36.03,12.3
  Top 0.406: O1.4 21.08,31.75 19.45,30.12 19.45,28.07 L1.P$2 | 25.91,24 26.16,23.75 X4.3 28.07,23.75 v28.32,23.75 | v26.23,1.4 26.29,1.4 27.3,2.41 27.3,3.94 | CONN1.2 33.92,3.94 | 33.92,3.94 27.3,3.94 | 33.92,3.94 36.58,3.94 | 37.47,8.78 37.47,4.83 36.58,3.94 | v28.82,13.38 28.13,12.7 28.13,11.68 28.13,6.92 27.3,6.1 X2.2 27.3,3.94 | 36.58,3.94 39.24,3.94 JP3.2
  Top 0.813: L1.P$2 20.47,24.2 C11.1 | C11.1 23.64,24.2 | 23.64,24.2 23.76,24.32 25.59,24.32 25.91,24 | 23.64,24.2 C1.1 | C11.1 21.4,24.01 C15.1 21.53,22.36 R11.2 C13.2 24.93,20.85 C14.1 24.57,20.32 R6.2
  Bottom 0.203: v26.23,1.4 26.12,1.29 v23.44,1.29 22.91,0.76 18.41,0.76 v16.89,2.29
  Bottom 0.254: v36.03,12.3 35.77,12.3 35.01,13.06 35.01,13.83 34.49,14.35 29.78,14.35 v28.82,13.38
  Bottom 0.406: v28.32,23.75 28.82,23.25 v28.82,13.38
!RESET  (via drill 0.39, 0.4)
  Top 0.203: SW2.B v7.87,3.36 SW2.B' 11.23,3.36 11.94,4.06 17.66,4.06 17.67,4.08 18.9,4.08 19.15,3.83 21.59,3.83 | Q5.3 32.33,8.56 v32.51,8.38 | v24.26,7.68 23.46,6.88 23.46,4.61 22.69,3.83 21.59,3.83 | v25.47,10.03 26,10.56 26,14.75 25.86,14.89 25.86,16.15 24.57,17.44 R6.1 24.57,17.83 26.08,17.83 26.29,18.03 26.29,19.43 26.61,19.75 X4.8 | C4.1 21.55,3.87 21.59,3.83
  Bottom 0.203: v32.51,8.38 30.73,10.16 27.56,10.16 | v24.26,7.68 24.33,7.62 26.54,7.62 27.56,8.64 27.56,10.16 | v25.47,10.03 25.6,10.16 27.56,10.16 | v7.87,3.36 7.69,3.17 TP3.P$1
+5V  (via drill 0.4)
  Top 0.203: C10.1 40.41,24.41 41.12,25.11 42.58,25.11 42.8,24.89 42.8,20.57 42.67,20.45 | IC5.5 42.67,20.45 | 42.67,20.45 42.93,20.19 42.93,17.91 v43.05,17.78 | IC4.5 42.87,14.86 v43,14.73
  Top 0.254: 40.65,13.57 40.81,13.73 40.82,13.73 41.27,14.18 41.27,14.49 41.64,14.86 IC4.5
  Top 0.305: IC1.9 32.98,10.28 v32.64,10.62 32.42,10.84 32.42,12.32 32.86,12.76 33.44,12.76 33.82,12.38 34.91,12.38 v35.81,13.29 | U2.5 23.24,13.1 23.96,13.1 25.09,11.98 v25.09,11.35 | 40.65,13.57 40.35,13.28 39.65,13.28 v39.43,13.49
  Top 0.406: U2.5 22.24,14.12 22.3,14.06 C8.1
  Bottom 0.203: v43.05,17.78 43,17.73 v43,14.73
  Bottom 0.305: v32.64,10.62 32.41,10.85 25.59,10.85 v25.09,11.35 | v35.81,13.29 36.06,13.04 36.39,13.04 37.23,12.19 38.7,12.19 39.43,12.92 v39.43,13.49
+24V  (via drill 0.4, 0.5)
  Top 0.203: R9.2 6.35,16.73 v6.35,13.97 | v18.1,12.13 18.16,12.19 19.81,12.19
  Top 0.406: U2.3 24.11,12.16 23.73,12.54 22.61,12.54 22.21,12.15 U2.1 22.21,9.7 C6.1 | C9.1 41.59,9.08 v42.04,9.53
  Top 0.508: C3.1 20.64,16.7 20.19,17.15 U$10.3
  Top 1.016: 20,11.75 PTC1.P$1 19.81,10.1 19.81,9.65 | 19.81,12.19 19.81,11.56 20,11.75 | C3.1 C7.1 20.64,12.38 20,11.75 | 19.81,9.65 19.81,8.83 20.51,8.83 C5.1 21.53,6.41 v21.97,5.97 | C6.1 19.81,9.65
  Bottom 0.203: v18.1,12.13 16.26,13.97 v6.35,13.97
  Bottom 0.406: v42.04,9.53 42,9.56 41.62,9.56
  Bottom 1.27: v21.97,5.97 21.97,5.33 23.37,3.94 36.01,3.94 41.59,9.53 v42.04,9.53 | 41.62,9.56 43.49,11.43 JP1.3 47.62,11.43 48.51,12.32 48.51,18.29 | 48.51,18.29 47.75,19.05 JP1.6 | JP1.9 48.01,26.67 48.51,26.16 48.51,18.29
BOOT
  Top 0.406: U$10.6 17.75,21.21 C12.1
CC1
  Top 0.203: X3.4 9.03,24.04 9.02,24.05 6.4,24.05 X5.A5
CC2
  Top 0.203: X5.B5 6.95,21.11 7.87,22.04 7.87,22.69 X3.5
D+  (via drill 0.4)
  Top 0.203: X5.A6 7.12,23.11 7.37,22.86 7.37,22.23 7.25,22.11 X5.B6 5.01,22.11 v4.64,22.48 | IC1.7 34.93,11.53 34.57,11.89 33.28,11.89 v33.15,12.02
  Bottom 0.203: v33.15,12.02 32.94,11.81 26.3,11.81 22.27,15.84 5.57,15.84 3.78,17.62 3.78,19.22 3.33,19.68 3.33,21.34 4.47,22.48 v4.64,22.48
D-  (via drill 0.4)
  Top 0.203: X5.A7 5.46,22.61 5.33,22.73 5.33,22.99 | 5.33,22.99 5.33,23.5 5.46,23.62 6.33,23.62 X5.B7 | IC1.8 34.33,11.12 v33.58,11.12 | v4.93,23.5 4.93,23.39 5.33,22.99
  Bottom 0.203: v33.58,11.12 33.38,11.33 26.2,11.33 22.1,15.43 5.4,15.43 3.38,17.45 3.38,19.05 2.92,19.51 2.92,22.04 4.38,23.5 v4.93,23.5
DTR
  Top 0.203: Q5.1 32.27,7.06 33.21,8 33.21,8.31 IC1.12 33.19,8.78 32.03,9.94 R1.1
FB3
  Top 0.203: U$10.4 20.7,21.24 20.7,20.03 21.38,19.36 R12.2 21.38,19 R11.1 C13.1
GND  (via drill 0.4)
  Top 0.203: IC4.2 40.89,14.86 41.02,14.99 41.02,15.96 40.75,15.96 40.75,19.16 41.15,19.55 41.15,20.45 IC5.2 | IC1.2 35.43,9.28 IC1.THERMAL v34.92,9.27 | R12.1 23.07,17.74 23.88,18.54 v25.59,18.54 | LED1.4 23.68,26.14 C1.2 | D3.C 44.51,27.75 43.81,27.05
  Top 0.254: 7.04,19.17 6.99,19.11 6.99,19.09 7.04,19.03 7.04,19.17 | 7.04,19.17 7.04,19.8 8.45,21.2 12.25,21.2 13.37,20.09 13.37,17.17 12.73,16.53 11.61,16.53 11.03,15.96 11.03,15.44 9.62,14.03 7.52,14.03 7.11,14.44 7.11,15.02 7.18,15.09 v7.18,17.78
  Top 0.406: C8.2 23.62,16.52 23.62,17.17 R12.1
  Top 0.61: v7.56,20.51 7.92,20.87 7.92,20.93 8.58,21.59 v8.83,21.59 | X3.GND 9.84,21.53 11.81,21.53 12,21.72 C2.2 12.16,22.2 R7.1
  other vias: 4.19,19.94 7.68,26.16 6.35,29.84 15.24,29.46 17.08,30.8 17.4,27.75 17.97,25.4 17.84,23.5 13.91,20.7 18.41,20.45 14.29,14.67 10.73,14.67 9.21,14.67 15.05,8.95 16.26,12.57 17.97,8.95 17.02,7.49 15.18,10.99 14.86,1.27 8.13,1.27 14.48,4.83 13.97,6.48 25.53,9.02 22.86,8 31.24,5.21 29.97,5.46 26.04,2.67 28.32,2.54 30.61,2.67 32.89,2.54 35.43,2.54 38.93,14.73 36.64,17.21 33.91,17.53 30.16,16 30.29,18.22 32.32,17.02 35.31,15.68 37.59,19.05 36.07,20.45 37.59,22.1 35.94,22.73 30.23,20.38 30.16,22.54 30.1,24.38 28.32,25.27 32.38,25.27 32.13,23.5 34.16,23.62 35.18,25.27 37.47,25.15 33.15,15.62 26.67,26.54 25.27,26.54 18.1,10.86 18.41,4.89 1.02,19.88 1.02,25.97 0.76,14.67 0.76,7.18 11.81,30.35 39.05,26.67 43.18,26.48 49.85,25.65 49.91,22.61 49.91,20.38 49.91,18.03 49.85,15.05 49.91,12.7 49.85,10.35 49.78,7.37 0.89,28.38 3.43,28.07 28,22.61 28,20.51 28,18.03 28,15.68 19.43,20.45 17.4,26.48 17.34,24.51 17.34,22.42 17.27,20.07 14.22,25.91 14.73,27.81
  pour Top: 0,32.89 0,0 50.8,0 50.8,27.05 17.78,27.05 17.65,33.13
  pour Bottom: 0,32.89 0,0 50.8,0 50.8,27.05 17.78,27.05 17.65,33.13
GPIO0  (via drill 0.39, 0.4)
  Top 0.203: Q5.6 29.45,6.68 v28.96,6.68 | X4.21 33.29,13.99 33.8,13.48 34.25,13.48 v34.28,13.45 | v24.23,6.1 24.23,4.29 23.37,3.43 18.45,3.43 R3.1 16.93,3.26 SW1.B' v14.03,3.36 SW1.B
  Bottom 0.203: v34.28,13.45 34.28,13.02 36.7,10.6 36.7,7.2 35.8,6.3 29.34,6.3 v28.96,6.68 28.83,6.68 28.5,6.35 24.48,6.35 v24.23,6.1 | v14.03,3.36 10.35,3.36 TP4.P$1
IO9
  Top 0.203: X4.25 36.49,12.91 38.35,11.05 38.35,5.59 38.96,4.98 39.85,4.98 40.54,4.29 40.54,2.13 41.4,1.27 JP3.3
IO10
  Top 0.203: X4.26 37.29,12.69 38.76,11.22 38.76,5.76 39.13,5.38 40.02,5.38 41.6,3.81 JP3.4
IO18  (via drill 0.4)
  Top 0.203: X4.30 38.05,17.35 v37.59,16.89 | v37.98,12.97 37.98,12.58 39.17,11.39 39.17,5.92 39.3,5.79 41.58,5.79 43.18,4.19 43.18,2.54 JP3.5
  Bottom 0.203: v37.59,16.89 37.98,16.51 v37.98,12.97
IR_RECV  (via drill 0.4)
  Top 0.203: O1.3 21.59,29.21 v21.46,29.08 | X4.11 25.91,17.35 v25.91,17.14
  Bottom 0.203: v21.46,29.08 21.08,28.7 21.08,25.53 26.29,20.32 26.29,17.53 v25.91,17.14
LED  (via drill 0.4)
  Top 0.203: X4.22 34.09,15.55 v34.16,15.62 | v43.31,27.56 43.31,29.04 R8.1
  Bottom 0.203: v34.16,15.62 34.16,16.14 36.05,18.03 37.97,18.03 38.73,18.8 38.73,24.26 42.04,27.56 v43.31,27.56
MIC_BCLK
  Top 0.203: IC2.4 21.5,0.82 21.97,0.36 23.88,0.36 24.13,0.6 24.13,2.41 25.73,4.01 25.73,6.07 27.22,7.57 27.22,14.06 27.66,14.5 X4.14
MIC_DATA
  Top 0.203: IC2.6 22.99,1.91 25.32,4.23 25.32,6.24 26.81,7.73 26.81,15.57 X4.13
MIC_WS
  Top 0.203: IC2.1 23.32,2.81 24.91,4.4 24.91,6.41 26.41,7.9 26.41,15.06 26.29,15.18 26.29,16.43 26.41,16.55 X4.12
N$1
  Top 0.203: R8.2 44.35,30.82 D3.A
N$2
  Top 0.203: X3.1 10.53,24.74 10.46,24.81 | 10.59,24.81 R2.1
  Top 0.406: C2.1 11.13,24.81 10.59,24.81 10.46,24.81
N$3
  Top 0.203: Q1.4 12.59,17.38 R5.2 10.41,16.11 R4.2
N$4
  Top 0.203: X3.10 10.53,18.74 10.22,18.44 R4.1
N$5  (via drill 0.39)
  Top 0.178: 7.87,17.59 7.87,18.33 8.15,18.61 9.01,18.61 9.55,19.15 9.55,20.32 X3.8
  Top 0.203: v7.81,14.73 7.87,14.73 7.87,17.59 | v9.15,29.07 9.15,27.63 SW3.3
  Bottom 0.203: v9.15,29.07 8.73,29.07 8.52,28.86 5.68,28.86 2.48,25.65 2.48,19.38 2.97,18.89 2.97,17.22 5.33,14.86 7.68,14.86 v7.81,14.73
N$6
  Top 0.203: SW3.2 12.17,26.69 13.59,25.27 R7.2
N$7
  Top 0.203: Q5.5 30.35,7.81 30.36,7.82 30.36,8.94 29.44,9.87 R1.8
N$8
  Top 0.203: Q5.2 31.25,7.81 30.94,8.13 30.94,9.01 30.41,9.53 30.41,10.36 30.89,10.84 R1.2
N$9
  Top 1.016: X7.PWR 10.87,10.29 10.87,6.84 12.13,5.59 D2.A
N$10
  Top 0.203: IC5.6 42.16,21.26 42.16,23.91 R13.1
N$11
  Top 0.203: IC5.4 42,18.97 R14.1
N$12
  Top 0.203: X3.9 10.03,19.07 R10.2
N$13
  Top 1.016: D2.C 13.46,8.65 13.46,10.23 PTC1.P$2 13.4,11.86 D1.C
N$14
  Top 0.813: Q1.5678 14.78,18.1 14.78,17.45 12.46,15.13 D1.A
N$15
  Top 0.203: D4.A R9.1
N$18
  Top 0.203: IC4.6 43.31,15.51 43.68,15.14 43.68,14.45 41.66,12.42 R15.1
N$19
  Top 0.203: IC4.4 42,13.7 41.62,13.32 41.05,13.32 40.26,12.53 R16.1
NEOPIX  (via drill 0.4)
  Top 0.203: X4.20 32.49,15.01 32.01,15.48 v31.75,15.48 | v24.57,27.37 24.45,27.37 LED1.1
  Bottom 0.203: v31.75,15.48 31.46,15.19 29.88,15.19 29.39,15.69 29.39,23.65 28.6,24.43 25.99,24.43 24.57,25.84 v24.57,27.37
RTS  (via drill 0.4)
  Top 0.203: Q5.4 29.41,8.56 28.7,9.27 | 28.7,9.27 28.7,7.97 v28.94,7.73 | 28.7,9.27 28.7,10.41 29.13,10.84 R1.7 | IC1.13 34.25,8.03 v33.53,7.3
  Bottom 0.203: v33.53,7.3 33.53,6.86 33.4,6.73 29.95,6.73 v28.94,7.73
RXD0  (via drill 0.4)
  Top 0.203: X4.35 39.05,21.6 39.94,21.6 40.24,21.91 v40.94,21.91 | v37.59,10.79 37.07,10.28 IC1.4
  Bottom 0.178: TP1.P$1 40.94,21.31 v40.94,21.91
  Bottom 0.203: v40.94,21.91 40.66,21.63 40.66,11.58 39.88,10.79 v37.59,10.79
S1
  Top 0.203: JP1.8 44.28,24.13 42.42,26 R13.2
S2
  Top 0.203: R14.2 45.43,16.8 JP1.5
S3
  Top 0.203: R15.2 43.18,10.71 45,8.89 JP1.2
S4
  Top 0.203: JP3.6 42.06,6.2 39.57,6.2 39.57,10.02 R16.2
SCL  (via drill 0.4)
  Top 0.203: R1.3 31.88,11.64 31.88,12.94 v31.36,13.45 31.36,13.65 30.89,14.12 X4.18 | CONN1.4 35.92,6.56 v35.5,6.99 | X3.7 9.03,19.45 8.81,19.23 v8.74,19.3
  Bottom 0.203: v35.5,6.99 35.56,6.99 36.2,7.62 36.2,10.52 33.52,13.2 31.61,13.2 v31.36,13.45 31.36,13.55 31.02,13.89 29.94,13.89 29.61,13.55 29.61,13.16 29.15,12.7 26.67,12.7 22.72,16.65 10.35,16.65 8.74,18.26 v8.74,19.3
SDA  (via drill 0.4)
  Top 0.203: R1.4 30.96,12.54 v30.29,13.21 29.97,13.21 29.29,13.89 X4.16 | v34.48,6.99 34.92,6.55 CONN1.3 | X3.6 7.75,19.57 v7.75,19.18
  Bottom 0.203: v34.48,6.99 35.69,8.19 35.69,10.45 33.43,12.7 30.8,12.7 v30.29,13.21 29.3,12.22 26.46,12.22 22.44,16.24 10.17,16.24 7.75,18.67 v7.75,19.18
SENSOR
  Top 0.203: X4.15 28.49,14.25 27.62,13.38 27.62,7.18 26.29,5.84 26.29,5.2 X2.1
SIG1
  Top 0.203: X4.34 39.34,20.55 39.74,20.94 40.14,20.94 IC5.1
SIG2
  Top 0.203: X4.33 40.25,19.75 IC5.3
SIG3
  Top 0.203: X4.32 39.98,18.95 40.34,18.59 40.34,15.55 IC4.1
SIG4
  Top 0.203: X4.31 39.77,18.15 39.88,18.03 39.88,16.26 39.62,16 39.62,14.44 39.85,14.21 IC4.3
SW  (via drill 0.39)
  Top 0.508: U$10.2 19.24,18.03 v19.11,17.9 | 15.41,22.22 C12.2
  Top 0.813: L1.P$1 15.85,22.91 v15.28,22.34 15.41,22.22 | v19.11,17.9 v18.1,17.9
  Bottom 0.813: v19.11,17.9 18.04,17.9 15.87,20.07 15.8,21.82 v15.28,22.34 16.17,22.3 v16.25,22.37
TXD0  (via drill 0.4)
  Top 0.203: IC1.5 36.46,11.56 v36.83,11.56 | v40.58,22.86 40.52,22.86 39.81,22.15 X4.36
  Bottom 0.178: TP2.P$1 40.75,23.04 v40.58,22.86
  Bottom 0.203: v40.58,22.86 40.26,22.54 40.26,11.81 40.01,11.56 v36.83,11.56
VBUS1  (via drill 0.5)
  Top 0.305: X5.B4A9 5.81,20.46 5.31,20.95 | X5.A4B9 5.81,25.26 5.57,25.02 4.7,25.02
  Top 0.406: Q1.3 Q1.2 Q1.1 12.34,19.07 R5.1 | X5.A4B9 7.17,25.26 7.48,24.94 8.75,24.94 R2.2
  Top 0.508: 5.31,20.95 4.32,20.95 3.68,21.59 3.68,24 4.7,25.02
  Top 0.813: v11.75,20.26 11.75,19.14 R5.1
  Top 1.016: R2.2 v7.62,24.89
  Bottom 1.016: v11.75,20.26 11.75,20.38 7.62,24.51 v7.62,24.89

### Text on the board
Pinguin_tBackup: 5 | 12 | 20 | LED | IR | Cellar Door | Neo | ESP32-Mini | + | USBPD | 21 | - | + | ON | 22 | - | + | CH343 | 19 | - | 5-24V | 27 | I2C | Reset | #0 | MIC
Pinguin_bBackup: IR Remote: 32 | LED: 4 | ESP32 4MB Flash / CH343 USB/Serial | NeoPix: 2 | V+ | #21 | USB PD / Type C | TX | GND | RX | V+ | 5A Fuse | 5V logic out | #22 | !!! WARNING !!! / VERIFY DC/PD VOLTS / NOT HIGHER THAN / LED MAX VIN!!! | GND | 5V Level / Outputs / S1:21 S2:22 / S3:19 S4:23 | V+ | 5V~24VDC | #19 | 10 | GND | 9 | ICS-43434 I2S Mic / SD:25 CK:26 WS:33 | 3.3V | 23 | JST SH: 27 | I2C SDA:14 SCL:13 | G | 18